# Altium schematic sheet POWER.SchDoc
size A3
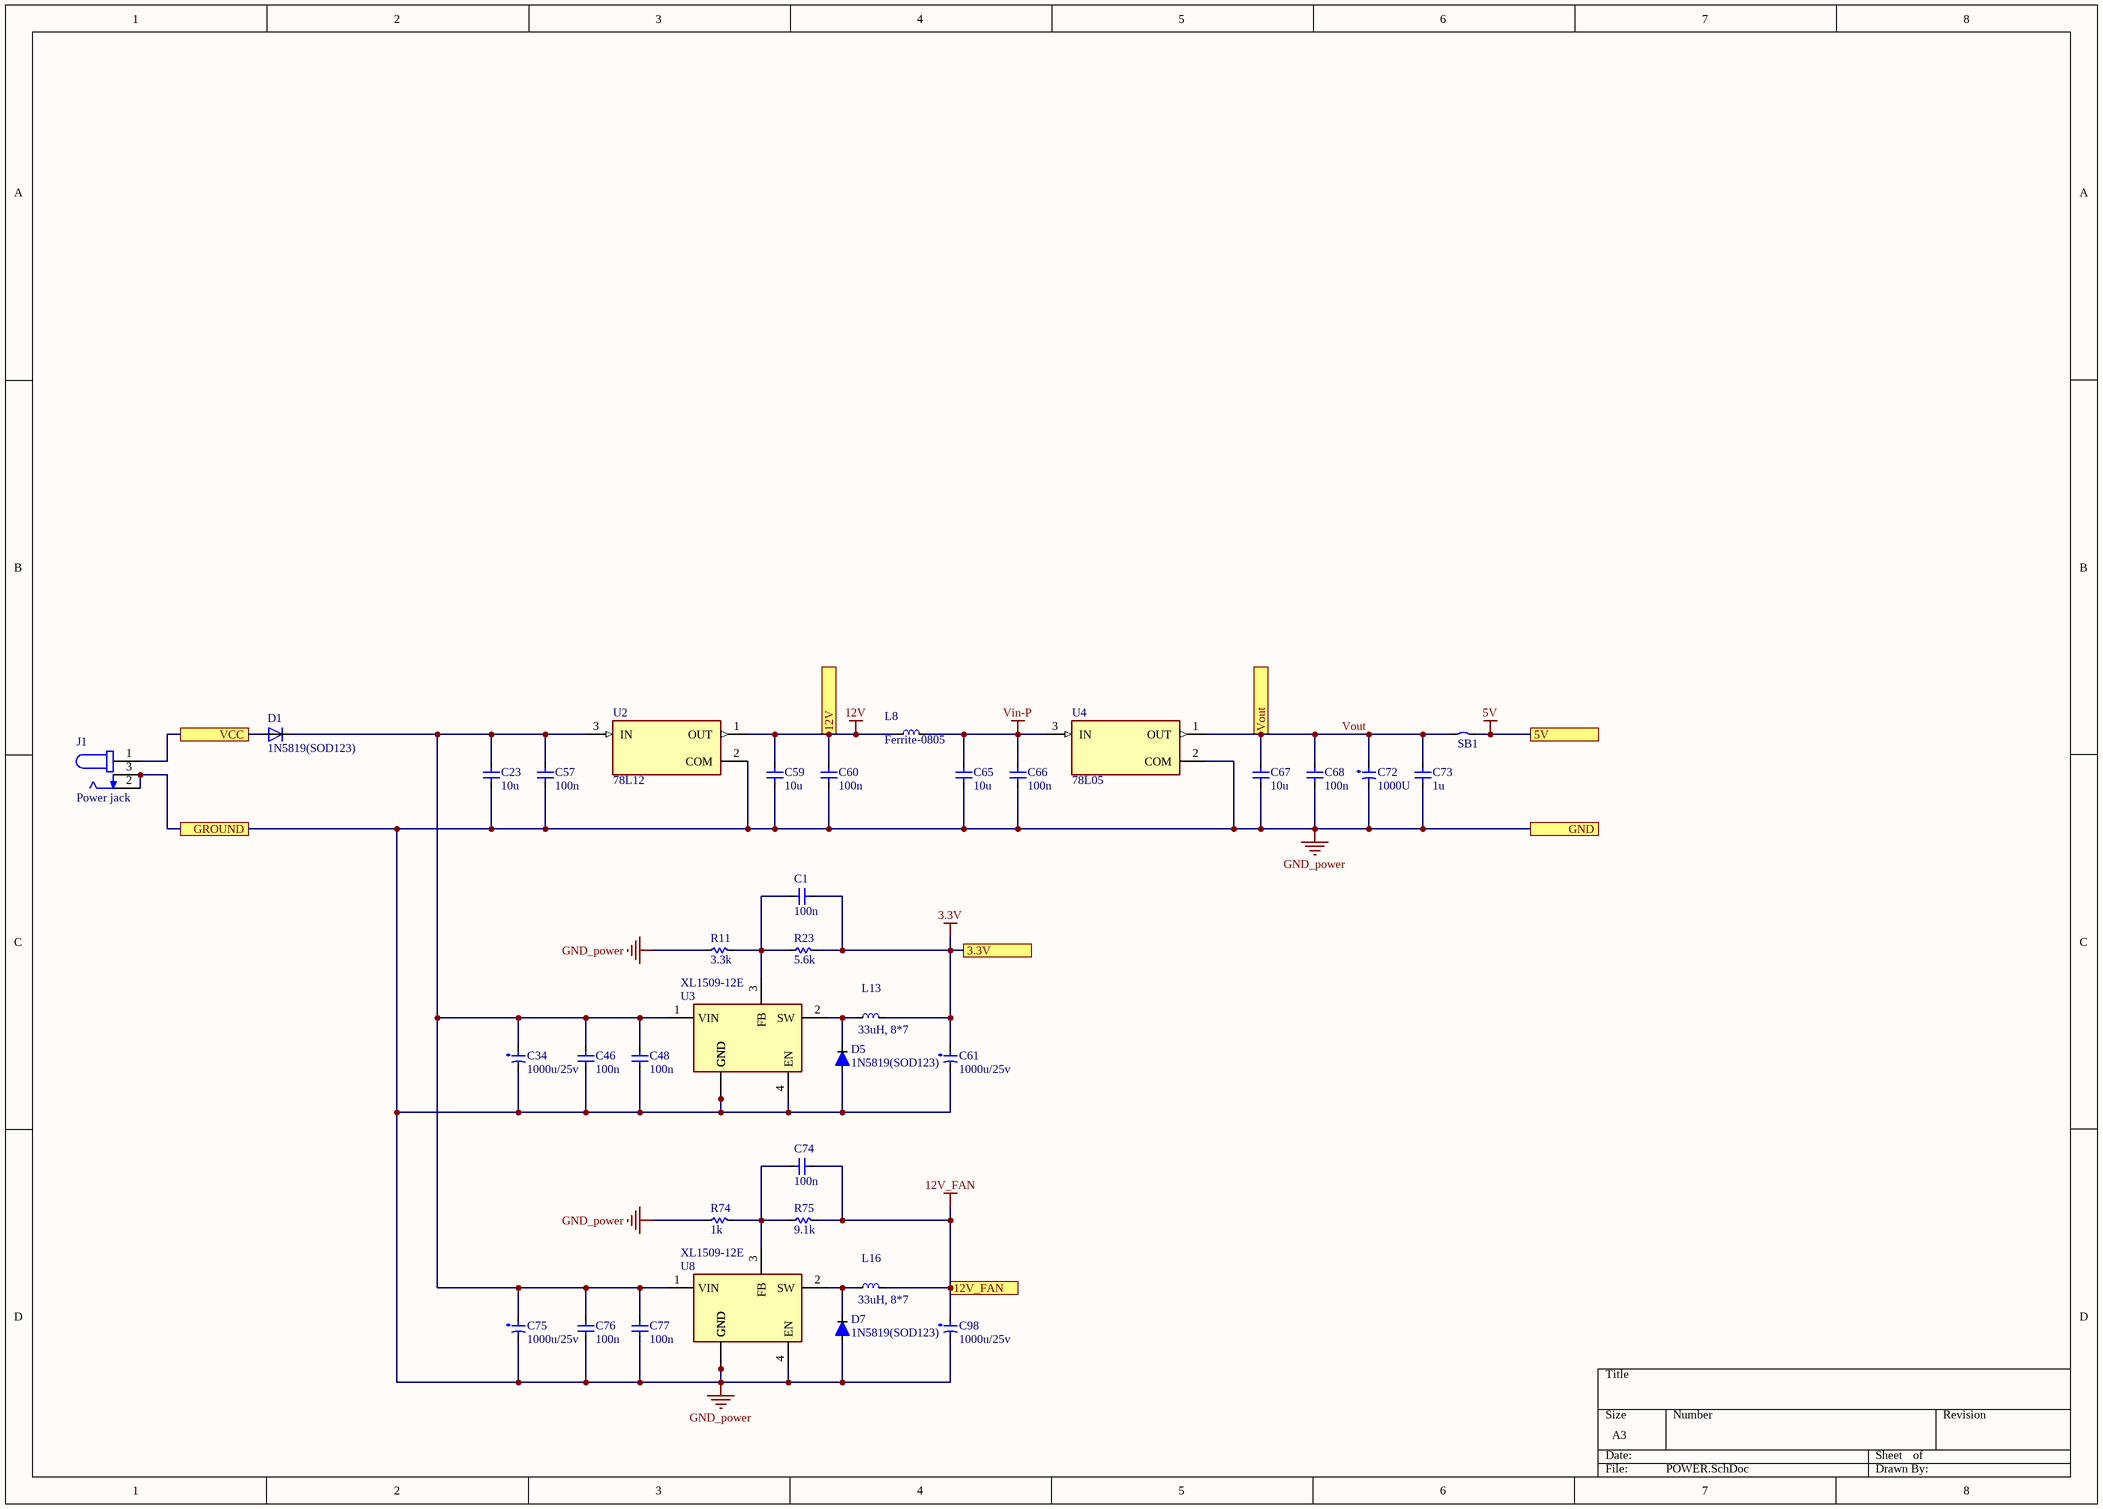
[diagram p0: POWER.SchDoc]

## Parts
C1  100n  [cap0603]
C23  10u  [CAP 0805]
C34  1000u/25v  [CAP DIP 10*13]
C46  100n  [cap0603]
C48  100n  [cap0603]
C57  100n  [cap0603]
C59  10u  [CAP 0805]
C60  100n  [cap0603]
C61  1000u/25v  [CAP DIP 10*13]
C65  10u  [CAP 0805]
C66  100n  [cap0603]
C67  10u  [CAP 0805]
C68  100n  [cap0603]
C72  1000U  [cap  dip 10*20]
C73  1u  [cap0603]
C74  100n  [cap0603]
C75  1000u/25v  [CAP DIP 10*13]
C76  100n  [cap0603]
C77  100n  [cap0603]
C98  1000u/25v  [CAP DIP 10*13]
D1  1N5819(SOD123)  [1N5819 SOD-123]
D5  1N5819(SOD123)  [1N5819 SOD-123]
D7  1N5819(SOD123)  [1N5819 SOD-123]
J1  Power jack  [Power jack]
L8  Ferrite-0805  [Ferrite-0805]
L13  33uH, 8*7  [Inductor 8*7]
L16  33uH, 8*7  [Inductor 8*7]
R11  3.3k  [RES-0603]
R23  5.6k  [RES-0603]
R74  1k  [RES-0603]
R75  9.1k  [RES-0603]
SB1  jumper  [JP2_SMD]  (value not drawn)
U2  78L12  [78L05]
U3  XL1509-12E  [FR9886]
U4  78L05  [78L05]
U8  XL1509-12E  [FR9886]

## Ports
3.3V, 5V, 12V, 12V_FAN, GND, GROUND, VCC, Vout

## Nets
3.3V: C1.1 C61.1(POS) L13.1 R23.2 ; port 3.3V
5V: SB1.2 ; port 5V
12V: C59.2 C60.2 L8.2 U2.1(OUT) ; port 12V
12V_FAN: C74.1 C98.1(POS) L16.1 R75.2 ; port 12V_FAN
GND_power: C23.1 C34.2(NEG) C46.1 C48.1 C57.1 C59.1 C60.1 C61.2(NEG) C65.1 C66.1 C67.1 C68.1 C72.2(NEG) C73.1 C75.2(NEG) C76.1 C77.1 C98.2(NEG) D5.2(C) D7.2(C) J1.2 J1.3 R11.1 R74.1 U2.2(COM) U3.4(EN) U3.5(GND) U3.6(GND) U3.7(GND) U3.8(GND) U4.2(COM) U8.4(EN) U8.5(GND) U8.6(GND) U8.7(GND) U8.8(GND) ; port GROUND, port GND
Vin-P: C65.2 C66.2 L8.1 U4.3(IN)
VCC: D1.2(A) J1.1 ; port VCC
Vout: C67.2 C68.2 C72.1(POS) C73.2 SB1.1 U4.1(OUT) ; port Vout
NetC1_2: C1.2 R11.2 R23.1 U3.3(FB)
NetC23_2: C23.2 C34.1(POS) C46.2 C48.2 C57.2 C75.1(POS) C76.2 C77.2 D1.1(K) U2.3(IN) U3.1(VIN) U8.1(VIN)
NetC74_2: C74.2 R74.2 R75.1 U8.3(FB)
NetD5_1: D5.1(A) L13.2 U3.2(SW)
NetD7_1: D7.1(A) L16.2 U8.2(SW)

## Library data of the parts
C1 C46 C48 C57 C60 C66 C68 C73 C74 C76 C77 = Cap 0603: Capacitor 0603; Value: 104; Published: 8-Jun-2000; LatestRevisionDate: 17-Jul-2002; LatestRevisionNote: Re-released for DXP Platform.; Publisher: Altium Limited
C23 C59 C65 C67 = Cap 0805: Capacitor 0805; Value: 104; Published: 8-Jun-2000; LatestRevisionDate: 17-Jul-2002; LatestRevisionNote: Re-released for DXP Platform.; Publisher: Altium Limited
C34 C61 C75 C98 = capacitor dip 10*13: 2200ÂµF 50V Aluminum Electrolytic Capacitors Radial, Can 1000 Hrs @ 105Â°C; MF: Nichicon; MP: UVZ1H222MHD; Package: Radial Nichicon; Value: *; Price: None; SnapEDA_Link: https://www.snapeda.com/parts/UVZ1H222MHD/Nichicon/view-part/468437/?ref=snap; Availability: Unavailable
C72 = capacitor dip 10*20: 2200ÂµF 50V Aluminum Electrolytic Capacitors Radial, Can 1000 Hrs @ 105Â°C; MF: Nichicon; MP: UVZ1H222MHD; Package: Radial Nichicon; Value: *; Price: None; SnapEDA_Link: https://www.snapeda.com/parts/UVZ1H222MHD/Nichicon/view-part/468437/?ref=snap; Availability: Unavailable
D1 D5 D7 = 1N5819(SOD123): Shotkey diod SOD-123; MP: BAS716; MF: Nexperia USA; SnapEDA_Link: https://www.snapeda.com/parts/BAS716/Nexperia%20USA%20Inc./view-part/143287/?ref=snap; Price: None; Package: SOD-523 NXP Semiconductors; Arrow_Electronics-Purchase-URL: https://snapeda.com/shop?store=Arrow+Electronics&id=143287; Value: *; Availability: Unavailable
J1 = Power jack: 2.0 x 6.5 mm, 2.5 A, Horizontal, Through Hole, Tapered Pins, Dc Power Jack Connector; MF: CUI Devices; MP: PJ-102A; CUI_purchase_URL: https://www.cuidevices.com/product/interconnect/connectors/dc-power-connectors/jacks/pj-102a?utm_source=snapeda.com&utm_medium=referral&utm_campaign=snapedaBOM; Price: None; SnapEDA_Link: https://www.snapeda.com/parts/PJ-102A/CUI%20Devices/view-part/55545/?ref=snap; Value: *; Availability: Unavailable; Package: None
L8 = Ferrite _0805: BLM Series 0805 330 Ohm 400 mA 0.58 Ohm DCR Surface Mount Ferrite Bead; MF: Murata; MP: BLM18BB331SN1D; Package: 0603 Murata; Price: None; Availability: Unavailable; SnapEDA_Link: https://www.snapeda.com/parts/BLM18BB331SN1D/Murata%20Electronics%20North%20America/view-part/?ref=snap; Value: *
L13 L16 = INDUCTOR 8*7: Inductor round 8*7; MP: DR127-330-R; MF: Eaton; Price: None; Package: Nonstandard Eaton; Availability: Unavailable; SnapEDA_Link: https://www.snapeda.com/parts/DR127-330-R/Eaton/view-part/?ref=snap; Value: *
R11 R23 R74 R75 = Res 0603: Resistor 0603; Published: 8-Jun-2000; LatestRevisionDate: 29-May-2009; LatestRevisionNote: IPC-7351 Footprint Added.; PackageReference: J1-0603; Publisher: Altium Limited; PackageDescription: Chip Resistor
SB1 = jumper: Circuit Breaker; Solder: NO; Revision: July-2002: Re-released for DXP Platform.
U2 U4 = 78L05: Linear Voltage Regulator IC 1 Output 100mA SOT-89-3; MP: UA78L05CPK; MF: Texas Instruments; Availability: Unavailable; Package: SOT-89-3 Texas Instruments; SnapEDA_Link: https://www.snapeda.com/parts/UA78L05CPK/Texas%20Instruments/view-part/512891/?ref=snap; Value: *; Price: None
U3 U8 = XL1509-12E: Regulator SOP-8; Manufacturer_Name: Fitipower; Manufacturer_Part_Number: FR9886SOGTR; Datasheet Link: https://www.insidegadgets.com/wp-content/uploads/2015/03/FR9886.pdf; Height: 1.75mm